# EAGLE schematic Light_Controller (EAGLE 7.1.0)
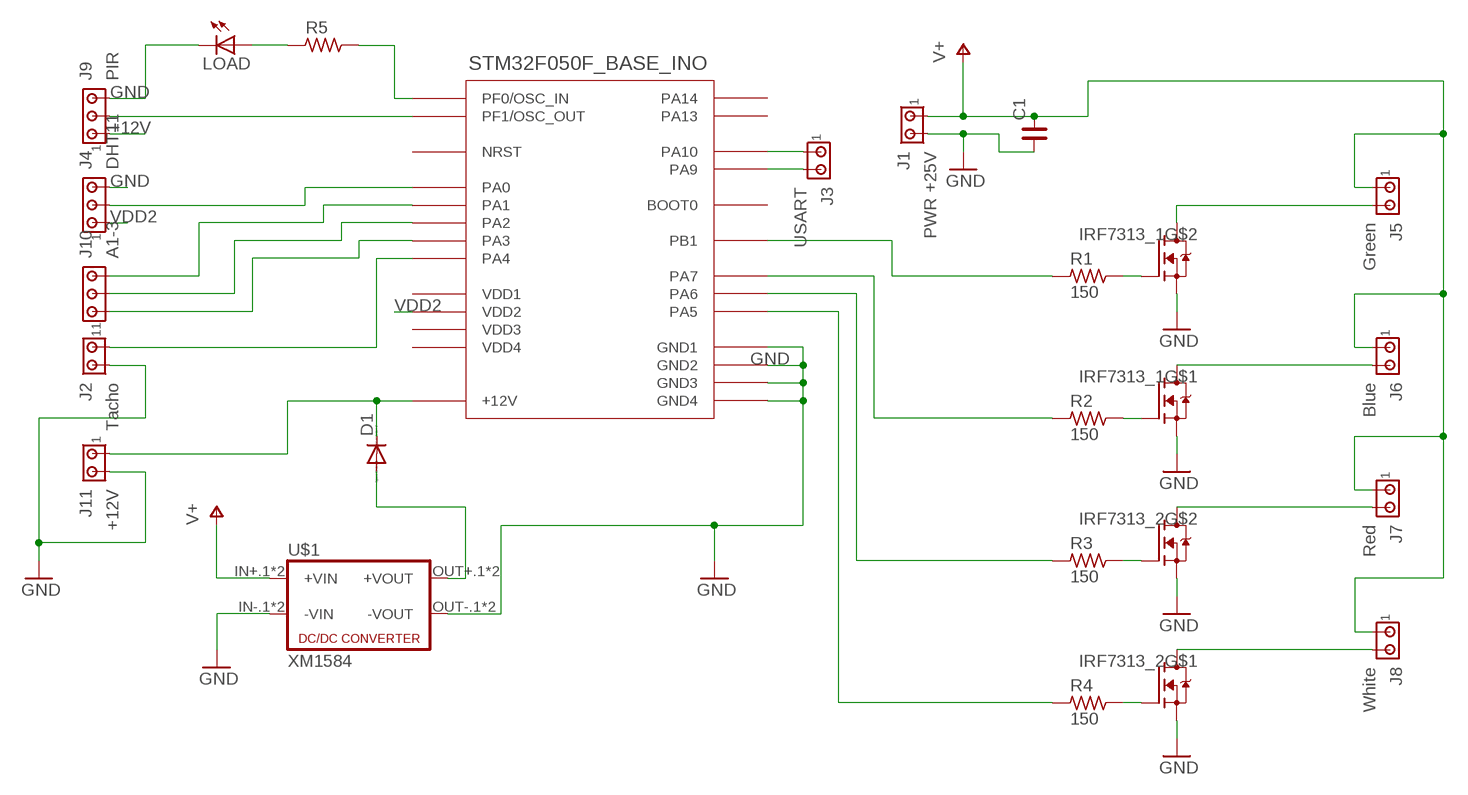
[diagram p0: schematic, sheet 1]

## Parts
C1  C_0603  [C0603]
D1  DIODE-DO214AC  [DO214AC]
IRF7313_1  IRF7313  [SO-8]
IRF7313_2  IRF7313  [SO-8]
J1  PWR +25V  MTA02-100  [10X02MTA]
J2  Tacho  MTA02-100  [10X02MTA]
J3  USART  MTA02-100  [10X02MTA]
J4  DHT11  MTA03-100  [10X03MTA]
J5  Green  MTA02-100  [10X02MTA]
J6  Blue  MTA02-100  [10X02MTA]
J7  Red  MTA02-100  [10X02MTA]
J8  White  MTA02-100  [10X02MTA]
J9  PIR  MTA03-100  [10X03MTA]
J10  A1-3  MTA03-100  [10X03MTA]
J11  +12V  MTA02-100  [10X02MTA]
LOAD  LEDCHIPLED_1206  [CHIPLED_1206]
R1  150  R_1206  [R1206]
R2  150  R_1206  [R1206]
R3  150  R_1206  [R1206]
R4  150  R_1206  [R1206]
R5  R_1206  [R1206]
STM321  STM32F050F_BASE_INO  [STM32_BASE_INO]
U$1  XM1584  [XM1584]

## Nets
+12V: D1.C J9.1 J11.1 STM321.+12V
GND [PWR]: C1.1 IRF7313_1.1(S) IRF7313_1.3(S) IRF7313_2.1(S) IRF7313_2.3(S) J1.2 J2.2 J4.3 J9.3 J11.2 LOAD.C STM321.GND1 STM321.GND2 STM321.GND3 STM321.GND4 U$1.IN-.1(-VIN) U$1.IN-.2(-VIN) U$1.OUT-.1(-VOUT) U$1.OUT-.2(-VOUT)
N$1: R1.1 STM321.PB1
N$2 [PWR]: IRF7313_1.5(D) IRF7313_1.6(D) J5.2
N$3: J2.1 STM321.PA4
N$4: R4.1 STM321.PA5
N$5: IRF7313_1.4(G) R1.2
N$6: IRF7313_1.2(G) R2.2
N$7: IRF7313_2.2(G) R4.2
N$8: IRF7313_2.4(G) R3.2
N$9: R3.1 STM321.PA6
N$10: R2.1 STM321.PA7
N$11: LOAD.A R5.1
N$12 [PWR]: IRF7313_1.7(D) IRF7313_1.8(D) J6.2
N$13: J3.1 STM321.PA10
N$14 [PWR]: IRF7313_2.5(D) IRF7313_2.6(D) J7.2
N$15: J3.2 STM321.PA9
N$16: R5.2 STM321.PF0(PF0/OSC_IN)
N$17: J4.2 STM321.PA0
N$18: J9.2 STM321.PF1(PF1/OSC_OUT)
N$19 [PWR]: IRF7313_2.7(D) IRF7313_2.8(D) J8.2
N$20: J10.3 STM321.PA1
N$21: J10.2 STM321.PA2
N$22: J10.1 STM321.PA3
N$23: D1.A U$1.OUT+.1(+VOUT) U$1.OUT+.2(+VOUT)
V+ [PWR]: C1.2 J1.1 J5.1 J6.1 J7.1 J8.1 U$1.IN+.1(+VIN) U$1.IN+.2(+VIN)
VDD2: J4.1 STM321.VDD2
Unconnected: STM321.BOOT0 STM321.NRST STM321.PA13 STM321.PA14 STM321.VDD1 STM321.VDD3 STM321.VDD4

## Library data of the parts
C1 = rc-master-smd:C_: NON-POLARIZED CAP
D1 = diode:DIODE-: DIODE
IRF7313_1 IRF7313_2 = my-library:IRF7313
J1-J3 J5-J8 J11 = con-amp:MTA02-100: AMP connector
J4 J9 J10 = con-amp:MTA03-100: AMP connector
LOAD = led:LED: LED OSRAM: - CHIPLED LG R971, LG N971, LY N971, LG Q971, LY Q971, LO R971, LY R971 LH N974, LH R974 LS Q976, LO Q976, LY Q976 LO Q996 - Hyper CHIPLED LW Q18S LB Q993, LB Q99A, LB R99A - SideLED LS A670, LO A670, LY A670, LG A670, LP A670 LB A673, LV A673, LT A673, LW A673 LH A674 LY A675 LS A676, LA A676, LO A676, LY A676, LW A676 LS A679, LY A679, LG A679 - Hyper Micro SIDELED® LS Y876, LA Y876, LO Y876, LY Y876 LT Y87S - SmartLED LW L88C, LW L88S LB L89C, LB L89S, LG L890 LS L89K, LO L89K, LY L89K LS L896, LA L896, LO L896, LY L896 - TOPLED LS T670, LO T670, LY T670, LG T670, LP T670 LSG T670, LSP T670, LSY T670, LOP T670, LYG T670 LG T671, LOG T671, LSG T671 LB T673, LV T673, LT T673, LW T673 LH T674 LS T676, LA T676, LO T676, LY T676, LB T676, LH T676, LSB T676, LW T676 LB T67C, LV T67C, LT T67C, LS T67K, LO T67K, LY T67K, LW E67C LS E67B, LA E67B, LO E67B, LY E67B, LB E67C, LV E67C, LT E67C LW T67C LS T679, LY T679, LG T679 LS T770, LO T770, LY T770, LG T770, LP T770 LB T773, LV T773, LT T773, LW T773 LH T774 LS E675, LA E675, LY E675, LS T675 LS T776, LA T776, LO T776, LY T776, LB T776 LHGB T686 LT T68C, LB T68C - Hyper Mini TOPLED® LB M676 - Mini TOPLED Santana® LG M470 LS M47K, LO M47K, LY M47K Source: http://www.osram.convergy.de LUXEON: - LUMILED® LXK2-PW12-R00, LXK2-PW12-S00, LXK2-PW14-U00, LXK2-PW14-V00 LXK2-PM12-R00, LXK2-PM12-S00, LXK2-PM14-U00 LXK2-PE12-Q00, LXK2-PE12-R00, LXK2-PE12-S00, LXK2-PE14-T00, LXK2-PE14-U00 LXK2-PB12-K00, LXK2-PB12-L00, LXK2-PB12-M00, LXK2-PB14-N00, LXK2-PB14-P00, LXK2-PB14-Q00 LXK2-PR12-L00, LXK2-PR12-M00, LXK2-PR14-Q00, LXK2-PR14-R00 LXK2-PD12-Q00, LXK2-PD12-R00, LXK2-PD12-S00 LXK2-PH12-R00, LXK2-PH12-S00 LXK2-PL12-P00, LXK2-PL12-Q00, LXK2-PL12-R00 Source: www.luxeon.com KINGBRIGHT: KA-3528ASYC Source: www.kingbright.com
R1-R5 = rc-master-smd:R_: RESISTOR
STM321 = my-library:STM32F050F_BASE_INO
U$1 = my-library:XM1584

## Net classes
1 PWR: width 0.635 mm, clearance 0.635 mm